# EAGLE design ATMegaFrequencyChangerOnlyNoProg (EAGLE 6.2)
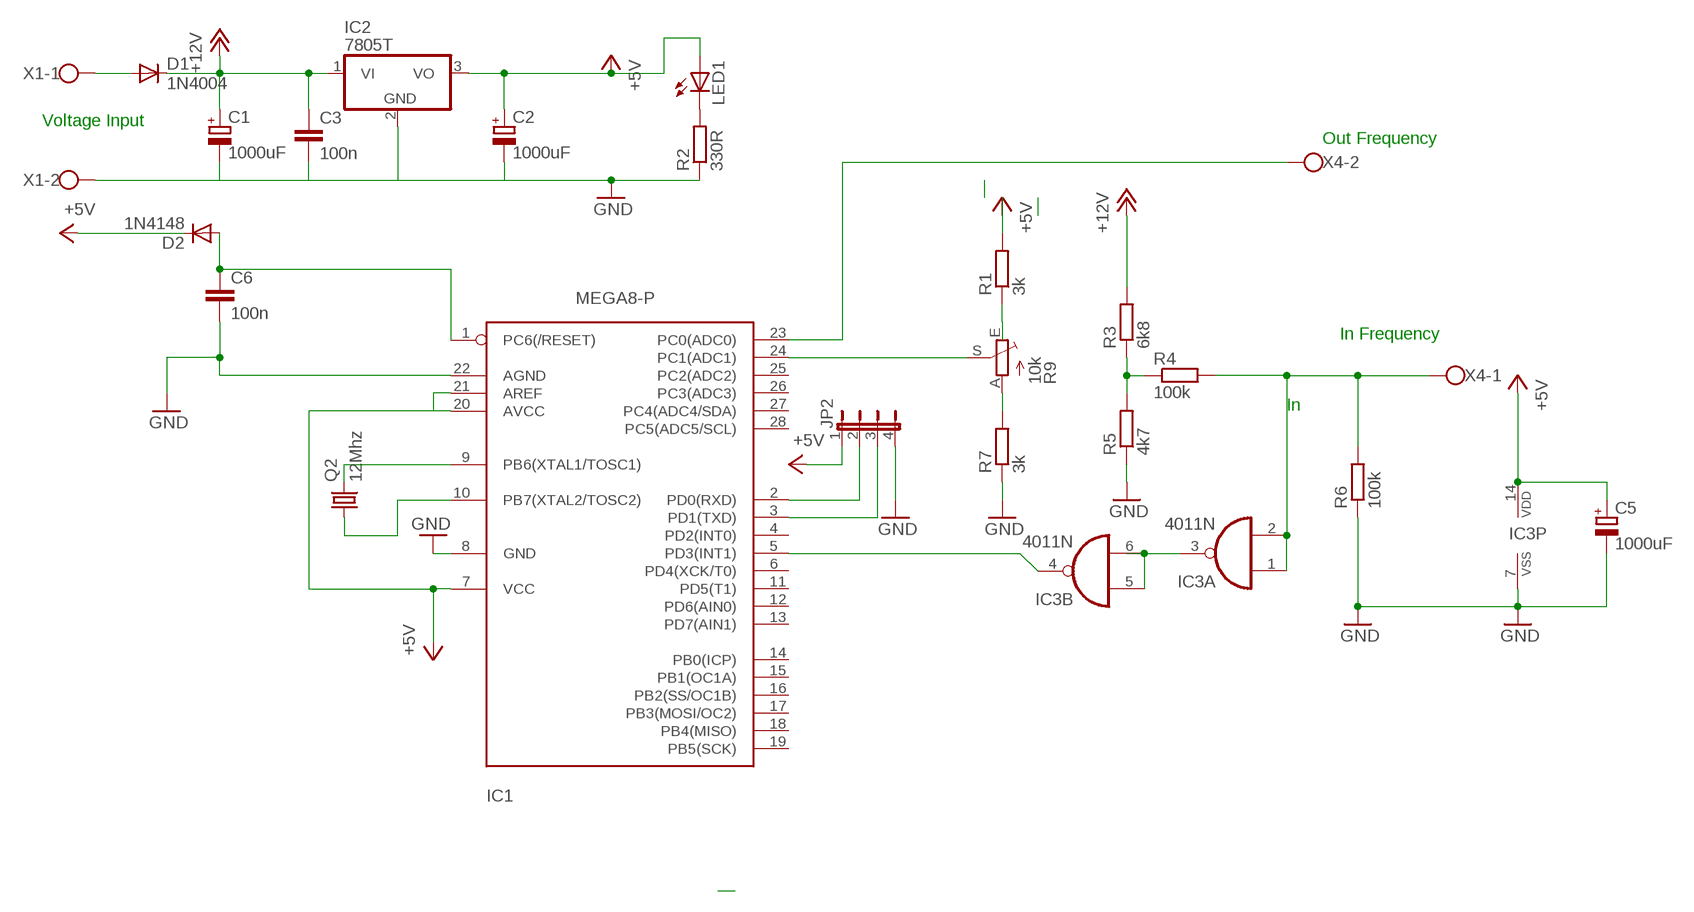
[diagram p0: schematic, sheet 1]

## Parts
C1  1000uF  CPOL-EUE2.5-7  [E2,5-7]
C2  1000uF  CPOL-EUE2.5-7  [E2,5-7]
C3  100n  C-EU025-024X044  [C025-024X044]
C5  1000uF  CPOL-EUE2.5-7  [E2,5-7]
C6  100n  C-EU025-024X044  [C025-024X044]
D1  1N4004  [DO41-10]
D2  1N4148  [DO35-10]
IC1  MEGA8-P  [DIL28-3]
IC2  7805T  [TO220H]
IC3  4011N  [DIL14]
JP2  JP4E  [JP4]
LED1  LED5MM  [LED5MM]
Q2  12Mhz  CRYSTALHC18U-V  [HC18U-V]
R1  3k  R-EU_0207/10  [0207/10]
R2  330R  R-EU_0204/5  [0204/5]
R3  6k8  R-EU_0207/10  [0207/10]
R4  100k  R-EU_0207/10  [0207/10]
R5  4k7  R-EU_0207/10  [0207/10]
R6  100k  R-EU_0207/10  [0207/10]
R7  3k  R-EU_0207/10  [0207/10]
R9  10k  TRIM_EU-RS3  [RS3]
X1  W237-02P  [W237-132]
X4  W237-02P  [W237-132]

## Nets
+5V: C2.+ C5.+ D2.C IC1.7(VCC) IC1.20(AVCC) IC1.21(AREF) IC2.3(VO) IC3.14(P:VDD) JP2.1 LED1.A R1.2
+12V: C1.+ C3.1 D1.C IC2.1(VI) R3.2
GND: C5.- IC3.7(P:VSS) R6.1
N$1: D1.A X1.1
N$2: IC1.23(PC0(ADC0)) X4.2
N$3: IC1.5(PD3(INT1)) IC3.4(B:O)
N$4: R3.1 R4.1 R5.2
N$5: IC3.3(A:O) IC3.5(B:I0) IC3.6(B:I1)
N$6: R1.1 R9.E
N$7: IC1.9(PB6(XTAL1/TOSC1)) Q2.2
N$8: R7.2 R9.A
N$10: IC1.2(PD0(RXD)) JP2.2
N$11: IC1.24(PC1(ADC1)) R9.S
N$12: IC1.10(PB7(XTAL2/TOSC2)) Q2.1
N$16: IC1.3(PD1(TXD)) JP2.3
N$17: IC3.1(A:I0) IC3.2(A:I1) R4.2 R6.2 X4.1
N$18: C1.- C2.- C3.2 C6.2 IC1.8(GND) IC1.22(AGND) IC2.2(GND) JP2.4 R2.1 R5.1 R7.1 X1.2 ; supply symbol labelled GND
N$19: C6.1 D2.A IC1.1(PC6(/RESET))
N$21: LED1.K(C) R2.2
Unconnected: IC1.4(PD2(INT0)) IC1.6(PD4(XCK/T0)) IC1.11(PD5(T1)) IC1.12(PD6(AIN0)) IC1.13(PD7(AIN1)) IC1.14(PB0(ICP)) IC1.15(PB1(OC1A)) IC1.16(PB2(SS/OC1B)) IC1.17(PB3(MOSI/OC2)) IC1.18(PB4(MISO)) IC1.19(PB5(SCK)) IC1.25(PC2(ADC2)) IC1.26(PC3(ADC3)) IC1.27(PC4(ADC4/SDA)) IC1.28(PC5(ADC5/SCL)) IC3.8(C:I0) IC3.9(C:I1) IC3.10(C:O) IC3.11(D:O) IC3.12(D:I0) IC3.13(D:I1)

## Notes on the sheet
- Voltage Input
- Out Frequency
- In Frequency
- In

## Library data of the parts
C1 C2 C5 = rcl:CPOL-EU: POLARIZED CAPACITOR, European symbol
C3 C6 = rcl:C-EU: CAPACITOR, European symbol
D1 = diode:1N4004: DIODE general purpose rectifier, 1 A
D2 = diode:1N4148: DIODE high speed (Philips)
IC1 = atmel:MEGA8-P: MICROCONTROLLER 8 Kbytes FLASH 1 kbytes SRAM 512 bytes EEPROM USART 4-channel 10 bit ADC 2-channel 8 bit ADC Source: avr.lbr
IC2 = linear:78*: Positive VOLTAGE REGULATOR Source: http://cache.national.com/ds/LM/LM78L05.pdf http://www.fairchildsemi.com/ds/LM/LM7805.pdf
IC3 = 40xx:4011: Quad 2-input NAND
JP2 = jumper:JP4E: JUMPER
LED1 = led:LED: LED OSRAM: - CHIPLED LG R971, LG N971, LY N971, LG Q971, LY Q971, LO R971, LY R971 LH N974, LH R974 LS Q976, LO Q976, LY Q976 LO Q996 - Hyper CHIPLED LW Q18S LB Q993, LB Q99A, LB R99A - SideLED LS A670, LO A670, LY A670, LG A670, LP A670 LB A673, LV A673, LT A673, LW A673 LH A674 LY A675 LS A676, LA A676, LO A676, LY A676, LW A676 LS A679, LY A679, LG A679 - Hyper Micro SIDELED® LS Y876, LA Y876, LO Y876, LY Y876 LT Y87S - SmartLED LW L88C, LW L88S LB L89C, LB L89S, LG L890 LS L89K, LO L89K, LY L89K LS L896, LA L896, LO L896, LY L896 - TOPLED LS T670, LO T670, LY T670, LG T670, LP T670 LSG T670, LSP T670, LSY T670, LOP T670, LYG T670 LG T671, LOG T671, LSG T671 LB T673, LV T673, LT T673, LW T673 LH T674 LS T676, LA T676, LO T676, LY T676, LB T676, LH T676, LSB T676, LW T676 LB T67C, LV T67C, LT T67C, LS T67K, LO T67K, LY T67K, LW E67C LS E67B, LA E67B, LO E67B, LY E67B, LB E67C, LV E67C, LT E67C LW T67C LS T679, LY T679, LG T679 LS T770, LO T770, LY T770, LG T770, LP T770 LB T773, LV T773, LT T773, LW T773 LH T774 LS E675, LA E675, LY E675, LS T675 LS T776, LA T776, LO T776, LY T776, LB T776 LHGB T686 LT T68C, LB T68C - Hyper Mini TOPLED® LB M676 - Mini TOPLED Santana® LG M470 LS M47K, LO M47K, LY M47K Source: http://www.osram.convergy.de - LUMILED® LXK2-PW12-R00, LXK2-PW12-S00, LXK2-PW14-U00, LXK2-PW14-V00 LXK2-PM12-R00, LXK2-PM12-S00, LXK2-PM14-U00 LXK2-PE12-Q00, LXK2-PE12-R00, LXK2-PE12-S00, LXK2-PE14-T00, LXK2-PE14-U00 LXK2-PB12-K00, LXK2-PB12-L00, LXK2-PB12-M00, LXK2-PB14-N00, LXK2-PB14-P00, LXK2-PB14-Q00 LXK2-PR12-L00, LXK2-PR12-M00, LXK2-PR14-Q00, LXK2-PR14-R00 LXK2-PD12-Q00, LXK2-PD12-R00, LXK2-PD12-S00 LXK2-PH12-R00, LXK2-PH12-S00 LXK2-PL12-P00, LXK2-PL12-Q00, LXK2-PL12-R00 Source: www.luxeon.com
Q2 = crystal:CRYSTAL: CRYSTAL
R1-R7 = rcl:R-EU_: RESISTOR, European symbol
R9 = pot:TRIM_EU-: POTENTIOMETER
X1 X4 = con-wago-508:W237-02P: WAGO SREW CLAMP

## Board
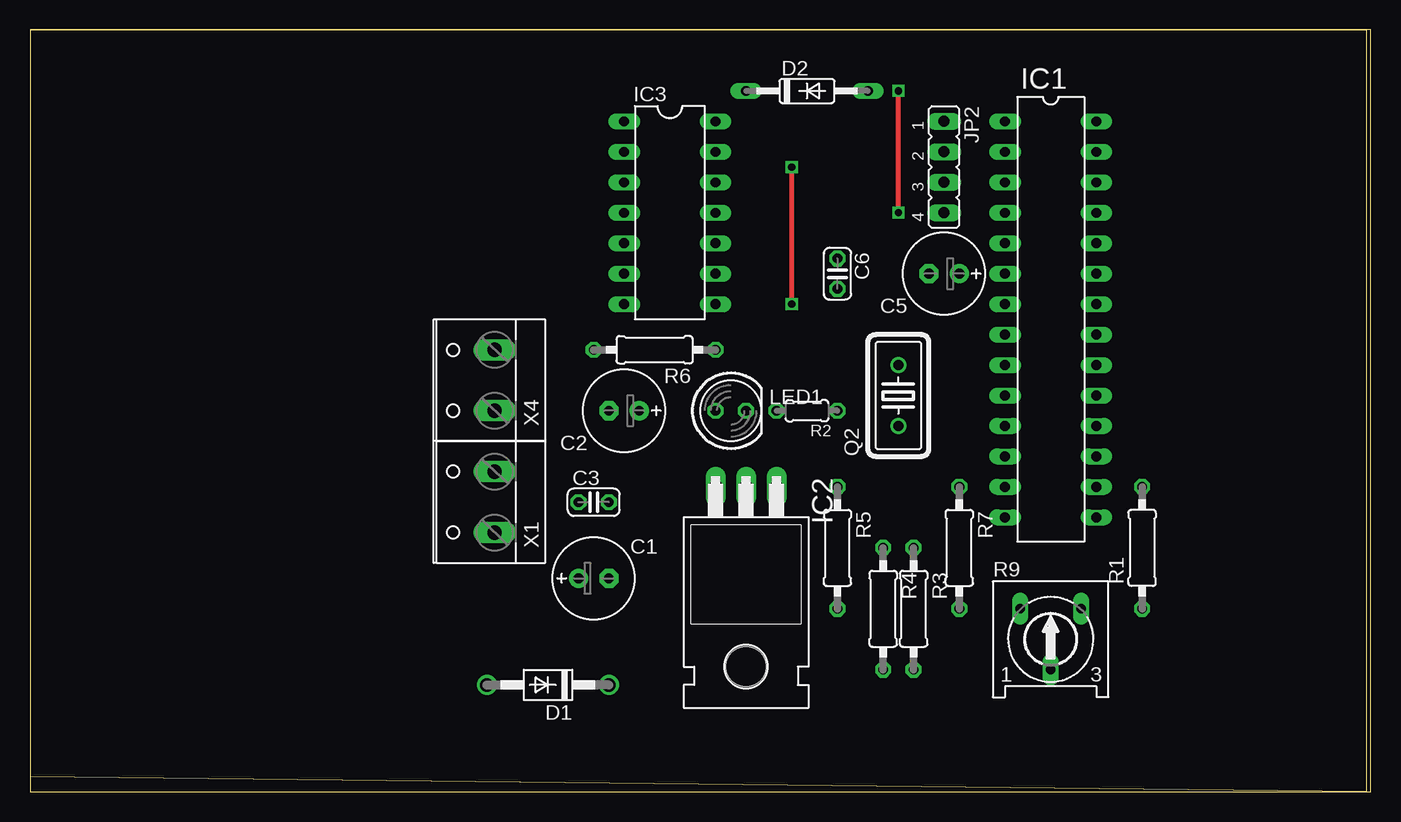
[diagram p1: board, top side]
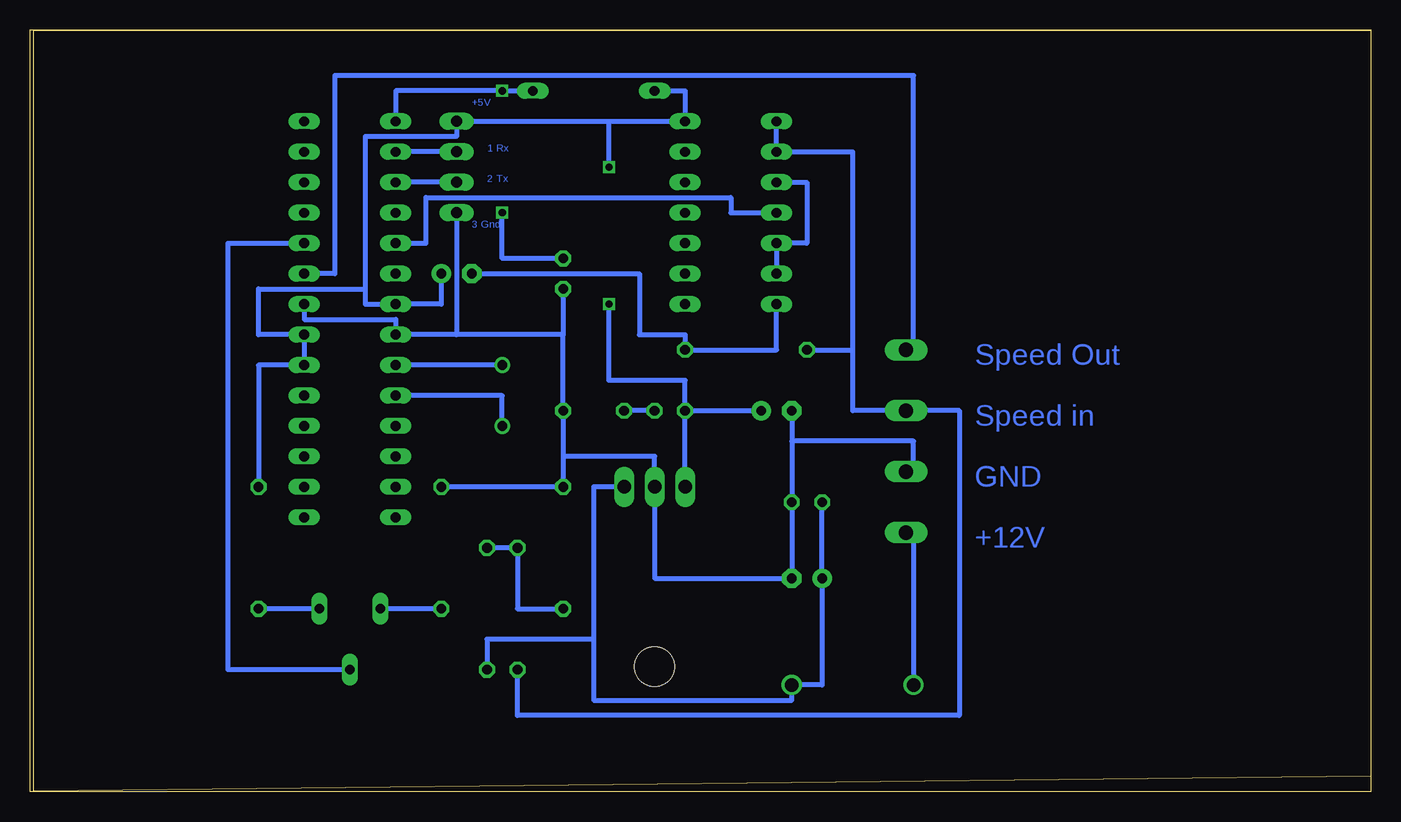
[diagram p2: board, bottom side, seen from below]

Size 111.76 x 63.5 mm. Coordinates in mm from the lower left corner, seen from the top.
Outline: 0,1.27 111.43,0 111.43,63.49 0,63.49 0,1.27
Copper layers (1*16): Top 0.035mm / dielectric 1.5mm / Bottom 0.035mm
Design rules: minimum track width 10mil, minimum drill 24mil, track to track 8mil, track to pad 8mil, pad to pad 8mil, via to via 8mil, smd to smd 8mil, copper to edge 40mil, drill to drill 8mil, minimum pad ring 10mil, minimum via ring 8mil, stop-mask expansion 4mil, vias tented up to drill 0mil, thermal gap 10mil

### Footprints (pad centres in the part's own frame; a part is rotated, then mirrored left to right if it is on the bottom)
E2,5-7 = drill 0.813 pad 1.6: + -1.27,0 | drill 0.813 pad 1.6 octagon: - 1.27,0
C025-024X044 = drill 0.813 octagon: 1 -1.27,0; 2 1.27,0
DO41-10 = drill 1.118: A 5.08,0; C -5.08,0
DO35-10 = drill 0.813 long: A 5.08,0; C -5.08,0
DIL28-3 = drill 0.813 long: 1 -16.51,-3.81; 2 -13.97,-3.81; 3 -11.43,-3.81; 4 -8.89,-3.81; 5 -6.35,-3.81; 6 -3.81,-3.81; 7 -1.27,-3.81; 8 1.27,-3.81; 9 3.81,-3.81; 10 6.35,-3.81; 11 8.89,-3.81; 12 11.43,-3.81; 13 13.97,-3.81; 14 16.51,-3.81; 15 16.51,3.81; 16 13.97,3.81; 17 11.43,3.81; 18 8.89,3.81; 19 6.35,3.81; 20 3.81,3.81; 21 1.27,3.81; 22 -1.27,3.81; 23 -3.81,3.81; 24 -6.35,3.81; 25 -8.89,3.81; 26 -11.43,3.81; 27 -13.97,3.81; 28 -16.51,3.81
TO220H = drill 1.118 long: 1 -2.54,-10.16; 2 0,-10.16; 3 2.54,-10.16 | hole 3.302: 0,4.826
DIL14 = drill 0.813 long: 1 -7.62,-3.81; 2 -5.08,-3.81; 3 -2.54,-3.81; 4 0,-3.81; 5 2.54,-3.81; 6 5.08,-3.81; 7 7.62,-3.81; 8 7.62,3.81; 9 5.08,3.81; 10 2.54,3.81; 11 0,3.81; 12 -2.54,3.81; 13 -5.08,3.81; 14 -7.62,3.81
JP4 = drill 0.914 long: 1 -3.81,0; 2 -1.27,0; 3 1.27,0; 4 3.81,0
LED5MM = drill 0.813 octagon: A -1.27,0; K 1.27,0
HC18U-V = drill 0.813: 1 -2.54,0; 2 2.54,0
0207/10 = drill 0.813 octagon: 1 -5.08,0; 2 5.08,0
0204/5 = drill 0.813 octagon: 1 -2.54,0; 2 2.54,0
RS3 = drill 0.813 long: A -2.54,2.54; E 2.54,2.54; S 0,-2.54
W237-132 = drill 1.194 long: 1 -2.54,-0.635; 2 2.54,-0.635

### Placement (x,y rotation side)
C1  46.99,17.78 0 top
C2  49.53,31.75 180 top
C3  46.99,24.13 0 top
C5  76.2,43.18 180 top
C6  67.31,43.18 270 top
D1  43.18,8.89 180 top
D2  64.77,58.42 0 top
IC1  85.09,39.37 270 top
IC2  59.69,15.24 180 top
IC3  53.34,48.26 270 top
JP2  76.2,52.07 270 top
LED1  58.42,31.75 0 top
Q2  72.39,33.02 90 top
R1  92.71,20.32 90 top
R2  64.77,31.75 180 top
R3  73.66,15.24 270 top
R4  71.12,15.24 270 top
R5  67.31,20.32 270 top
R6  52.07,36.83 180 top
R7  77.47,20.32 270 top
R9  85.09,12.7 0 top
X1  38.1,24.13 90 top
X4  38.1,34.29 90 top

### Tracks (layer width: path | path; a pad name or v marks a point on that pad's centre or on a via)
+5V  (via drill 0.6)
  Top 0.406: v63.5,40.64 v63.5,52.07
  Bottom 0.406: LED1.A C2.+ | R1.2 92.71,35.56 IC1.20 IC1.21 92.71,38.1 92.71,41.91 83.82,41.91 | C5.+ 77.47,40.64 IC1.7 83.82,40.64 83.82,41.91 | 83.82,41.91 83.82,54.61 76.2,54.61 JP2.1 63.5,55.88 | 63.5,55.88 IC3.14 57.15,58.42 D2.C | IC2.3 LED1.A | LED1.A 57.15,34.29 63.5,34.29 v63.5,40.64 | v63.5,52.07 63.5,55.88
+12V
  Bottom 0.406: C3.1 C1.+ 45.72,8.89 D1.C 48.26,7.62 64.77,7.62 64.77,12.7 | 64.77,12.7 64.77,25.4 IC2.1 | 64.77,12.7 73.66,12.7 R3.2
GND
  Bottom 0.406: IC3.7 49.53,36.83 R6.1 57.15,38.1 60.96,38.1 60.96,43.18 C5.-
N$1
  Bottom 0.254: 38.1,21.59 X1.1
  Bottom 0.406: 38.1,21.59 D1.A
N$2
  Bottom 0.406: IC1.23 86.36,43.18 86.36,59.69 38.1,59.69 38.1,36.83 X4.2
N$3
  Bottom 0.406: IC1.5 78.74,45.72 78.74,49.53 53.34,49.53 53.34,48.26 IC3.4
N$4
  Bottom 0.406: R3.1 R4.1 71.12,15.24 R5.2
N$5
  Bottom 0.406: IC3.3 46.99,50.8 46.99,45.72 IC3.5 IC3.6
N$6
  Bottom 0.406: R9.E R1.1
N$7
  Bottom 0.406: Q2.2 IC1.9
N$8
  Bottom 0.406: R7.2 R9.A
N$10
  Bottom 0.406: JP2.2 IC1.2
N$11
  Bottom 0.406: IC1.24 95.25,45.72 95.25,10.16 R9.S
N$12
  Bottom 0.406: Q2.1 72.39,33.02 IC1.10
N$16
  Bottom 0.406: JP2.3 IC1.3
N$17
  Bottom 0.406: R4.2 71.12,6.35 34.29,6.35 34.29,31.75 X4.1 43.18,31.75 43.18,36.83 | IC3.1 IC3.2 43.18,53.34 43.18,36.83 | R6.2 43.18,36.83
N$18
  Bottom 0.406: X1.2 38.1,26.67 38.1,29.21 48.26,29.21 | C2.- 48.26,29.21 | 48.26,29.21 C3.2 C1.- 59.69,17.78 IC2.2 59.69,27.94 67.31,27.94 | 67.31,27.94 R2.1 67.31,38.1 | 67.31,27.94 R5.1 R7.1 | JP2.4 76.2,38.1 | 76.2,38.1 IC1.8 81.28,39.37 88.9,39.37 IC1.22 | 67.31,38.1 76.2,38.1 | C6.2 67.31,38.1
N$19  (via drill 0.6)
  Top 0.406: v72.39,48.26 v72.39,58.42
  Bottom 0.406: IC1.1 81.28,58.42 v72.39,58.42 D2.A | C6.1 72.39,44.45 v72.39,48.26
N$21
  Bottom 0.406: LED1.K R2.2

### Text on the board
Bottom: +5V | 1 Rx | 2 Tx | 3 Gnd | Speed Out | Speed in | GND | +12V